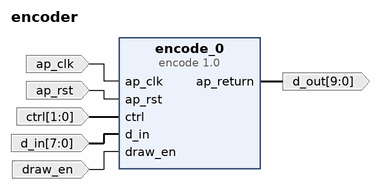
[diagram p0: block diagram of the top level]
# Vivado block design encoder, xc7z010clg400-1, Vivado 2022.2
create_bd_design encoder

create_bd_port -dir I -type clk ap_clk
set_property -dict {CONFIG.ASSOCIATED_RESET ap_rst} [get_bd_ports ap_clk]
create_bd_port -dir O -from 9 -to 0 -type data d_out
create_bd_port -dir I -type rst ap_rst
set_property -dict {CONFIG.POLARITY ACTIVE_HIGH} [get_bd_ports ap_rst]
create_bd_port -dir I -from 1 -to 0 -type data ctrl
create_bd_port -dir I -from 7 -to 0 -type data d_in
create_bd_port -dir I -type data draw_en

create_bd_cell -type ip -vlnv xilinx.com:ZAMFP:encode:1.0 encode_0

# ---- connections ----

connect_bd_net -net ap_clk_0_1 [get_bd_ports ap_clk] [get_bd_pins encode_0/ap_clk]
connect_bd_net -net ap_rst_0_1 [get_bd_ports ap_rst] [get_bd_pins encode_0/ap_rst]
connect_bd_net -net ctrl_0_1 [get_bd_ports ctrl] [get_bd_pins encode_0/ctrl]
connect_bd_net -net d_in_0_1 [get_bd_ports d_in] [get_bd_pins encode_0/d_in]
connect_bd_net -net draw_en_0_1 [get_bd_ports draw_en] [get_bd_pins encode_0/draw_en]
connect_bd_net [get_bd_pins encode_0/ap_return] [get_bd_ports d_out]

validate_bd_design
save_bd_design
